# Altium schematic sheet 11_BREAK_OFF.SchDoc: SENSEI Base Board - Breakoff
size A3; DrawnBy: Sebastian Frey; Organization: Integrated Systems Laboratory; DocumentNumber: 12; Revision: v1.1; SheetNumber: 12; SheetTotal: 12
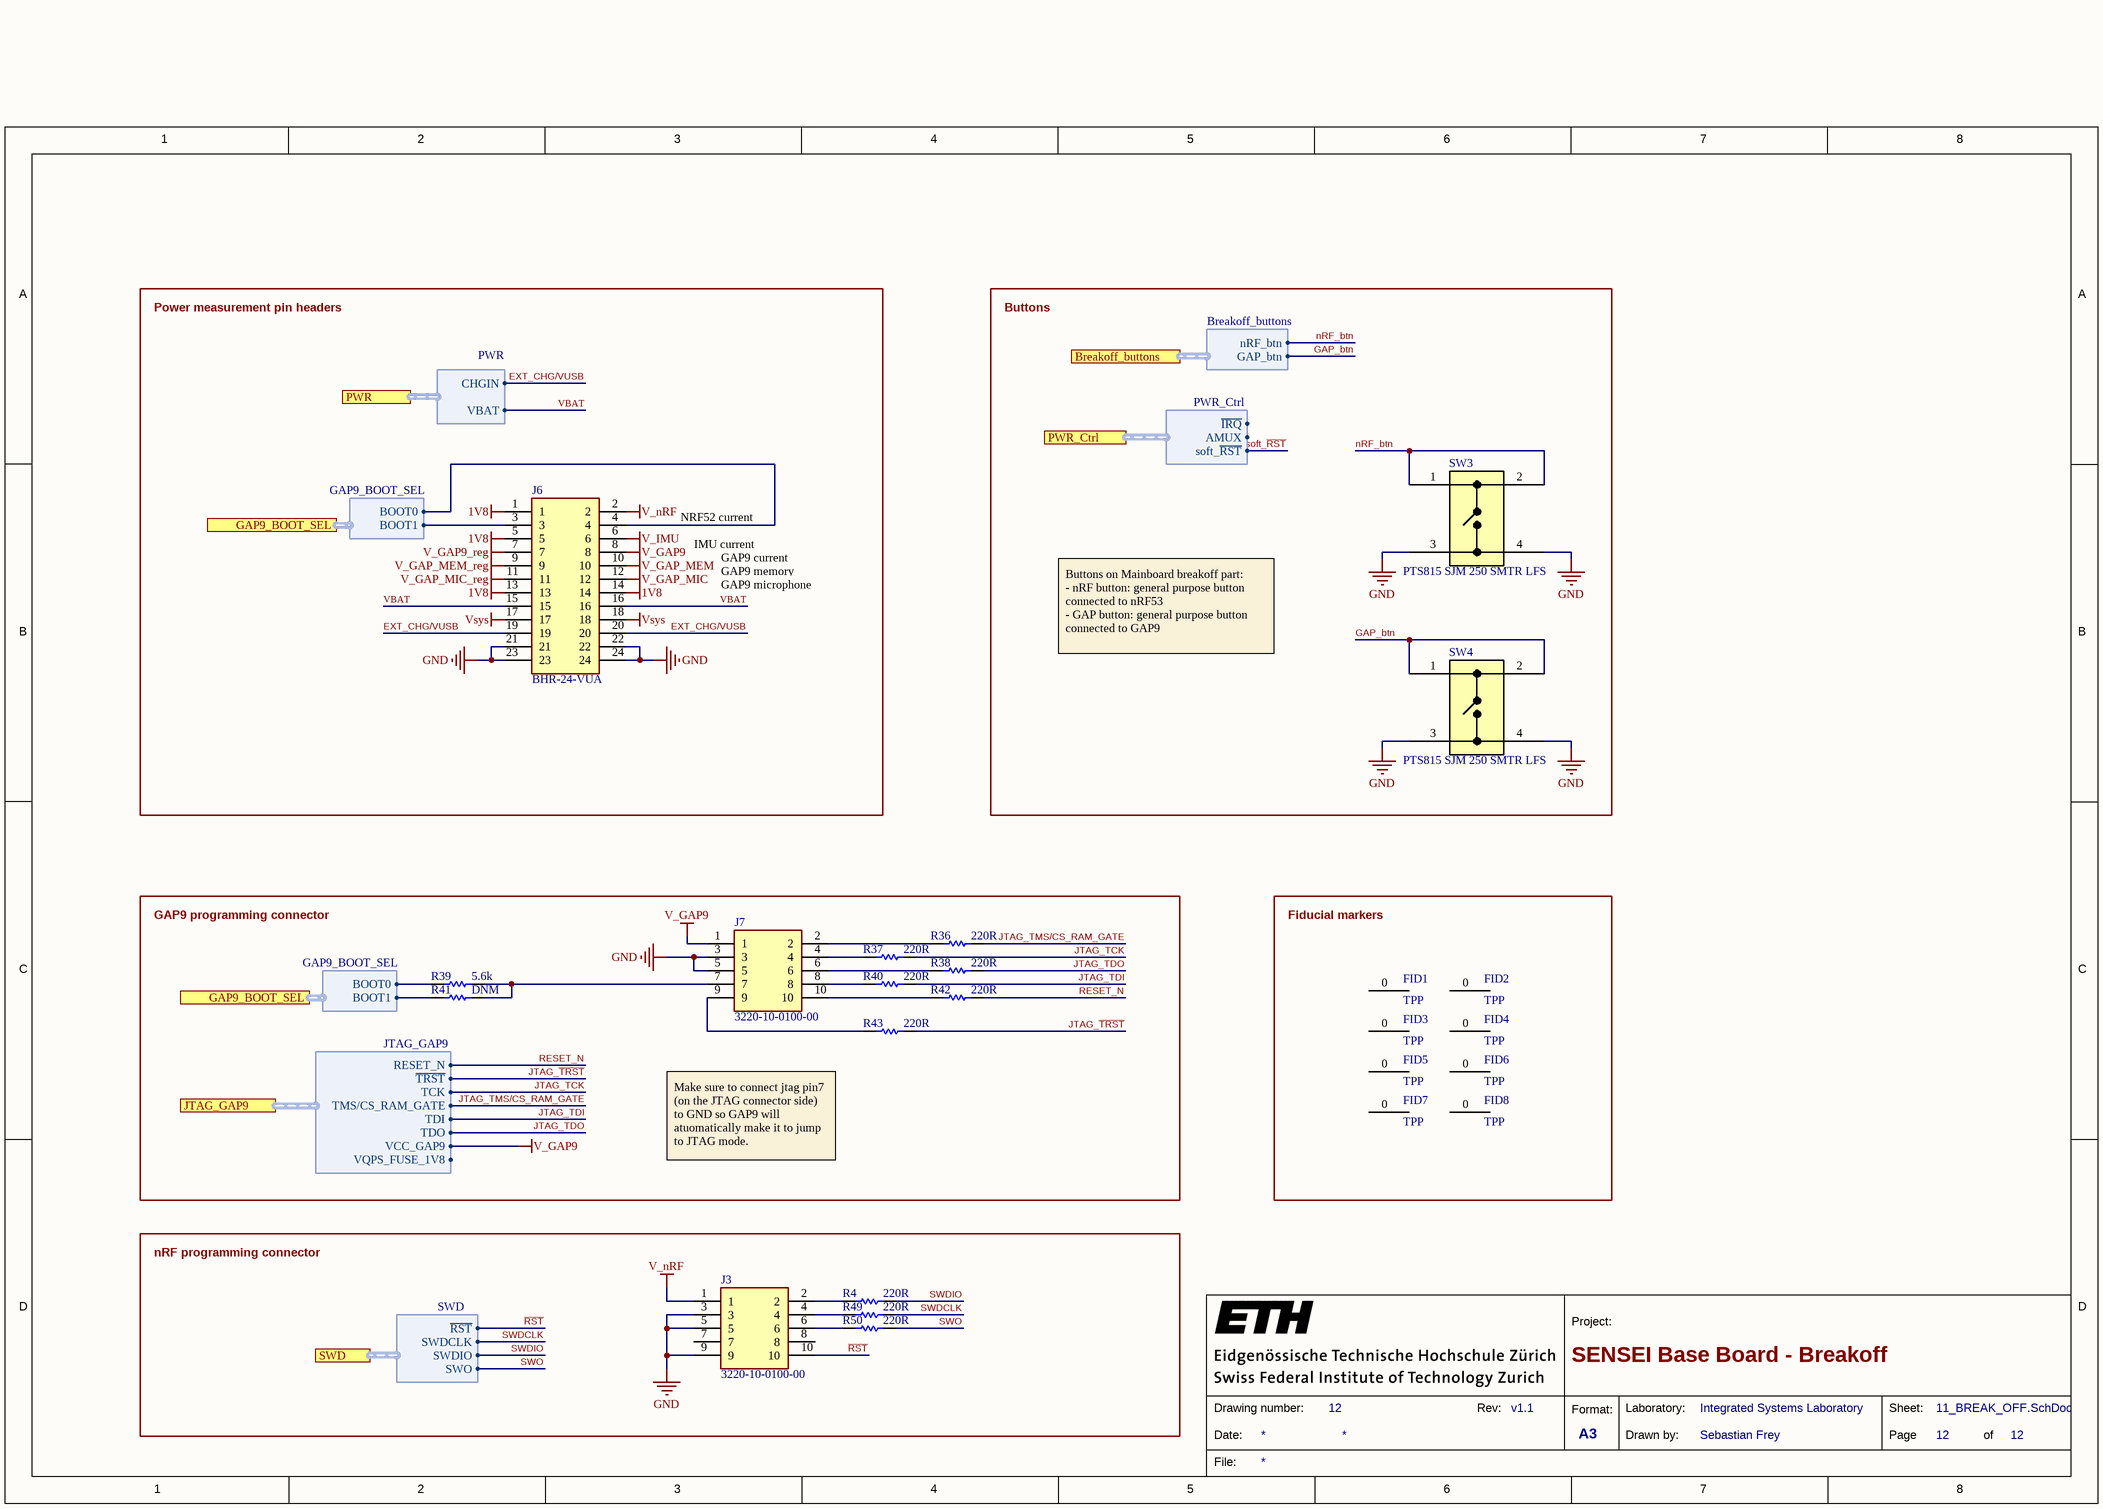
[diagram p0: 11_BREAK_OFF.SchDoc]

## Parts
FID1  TPP  [TPP]
FID2  TPP  [TPP]
FID3  TPP  [TPP]
FID4  TPP  [TPP]
FID5  TPP  [TPP]
FID6  TPP  [TPP]
FID7  TPP  [TPP]
FID8  TPP  [TPP]
J3  3220-10-0100-00  [322010010000]
J6  BHR-24-VUA  [SHDR24W64P254_2X12_3808X880X910P]
J7  3220-10-0100-00  [322010010000]
R4  value 220R  [RESC0603X28X15NL05T05]  (hidden comment: CRCW0201220RFKED)
R36  value 220R  [RESC0603X28X15NL05T05]  (hidden comment: CRCW0201220RFKED)
R37  value 220R  [RESC0603X28X15NL05T05]  (hidden comment: CRCW0201220RFKED)
R38  value 220R  [RESC0603X28X15NL05T05]  (hidden comment: CRCW0201220RFKED)
R39  Resistance: 5.6k  [RESC1608X55X30ML20T10]  (hidden comment: RK73B1JTTD562J)
R40  value 220R  [RESC0603X28X15NL05T05]  (hidden comment: CRCW0201220RFKED)
R41  DNM  [RESC1608X55X30ML20T10]
R42  value 220R  [RESC0603X28X15NL05T05]  (hidden comment: CRCW0201220RFKED)
R43  value 220R  [RESC0603X28X15NL05T05]  (hidden comment: CRCW0201220RFKED)
R49  value 220R  [RESC0603X28X15NL05T05]  (hidden comment: CRCW0201220RFKED)
R50  value 220R  [RESC0603X28X15NL05T05]  (hidden comment: CRCW0201220RFKED)
SW3  PTS815 SJM 250 SMTR LFS  [SW4_PTS815 SJM 250 SMTR LFS_CNK]
SW4  PTS815 SJM 250 SMTR LFS  [SW4_PTS815 SJM 250 SMTR LFS_CNK]

## Blocks framed on the sheet
Power measurement pin headers: J6
Buttons: SW3 SW4
GAP9 programming connector: J7 R36-R43
Fiducial markers: FID1-FID8
nRF programming connector: J3 R4 R49 R50

## Ports
Breakoff_buttons (harness Breakoff_buttons), GAP9_BOOT_SEL (harness GAP9_BOOT_SEL), JTAG_GAP9 (harness JTAG_GAP9), PWR (harness PWR), PWR_Ctrl (harness PWR_Ctrl), SWD (harness SWD)

## Harnesses
PWR: CHGIN, VBAT
GAP9_BOOT_SEL: BOOT0, BOOT1
Breakoff_buttons: nRF_btn, GAP_btn
JTAG_GAP9: ~{TRST}, TCK, TMS/CS_RAM_GATE, TDI, TDO, VCC_GAP9, RESET_N, VQPS_FUSE_1V8
SWD: ~{RST}, SWDIO, SWDCLK, SWO
PWR_Ctrl: ~{IRQ}, AMUX, soft_~{RST}

## Nets
1V8: J6.1 J6.5 J6.13 J6.14
GND: J3.3 J3.5 J3.9 J6.21 J6.22 J6.23 J6.24 J7.3 J7.5 SW3.3 SW3.4 SW4.3 SW4.4
V_GAP9: J6.8 J7.1 ; port JTAG_GAP9.VCC_GAP9
V_GAP9_reg: J6.7
V_GAP_MEM: J6.10
V_GAP_MEM_reg: J6.9
V_GAP_MIC: J6.12
V_GAP_MIC_reg: J6.11
V_IMU: J6.6
V_nRF: J3.1 J6.2
Vsys: J6.17 J6.18
EXT_CHG/VUSB: J6.19 J6.20 ; port PWR.CHGIN
GAP_btn: SW4.1 SW4.2 ; port Breakoff_buttons.GAP_btn
JTAG_~{TRST}: R43.2 ; port JTAG_GAP9.~{TRST}
JTAG_TCK: R37.2 ; port JTAG_GAP9.TCK
JTAG_TDI: R40.2 ; port JTAG_GAP9.TDI
JTAG_TDO: R38.2 ; port JTAG_GAP9.TDO
JTAG_TMS/CS_RAM_GATE: R36.2 ; port JTAG_GAP9.TMS/CS_RAM_GATE
nRF_btn: SW3.1 SW3.2 ; port Breakoff_buttons.nRF_btn
~{RST}: J3.10 ; port SWD.~{RST}
RESET_N: R42.2 ; port JTAG_GAP9.RESET_N
soft_~{RST}: port PWR_Ctrl.soft_~{RST}
SWDCLK: R49.2 ; port SWD.SWDCLK
SWDIO: R4.2 ; port SWD.SWDIO
SWO: R50.2 ; port SWD.SWO
VBAT: J6.15 J6.16 ; port PWR.VBAT
NetJ3_2: J3.2 R4.1
NetJ3_4: J3.4 R49.1
NetJ3_6: J3.6 R50.1
NetJ6_3: J6.3 R41.1 ; port GAP9_BOOT_SEL.BOOT1
NetJ6_4: J6.4 R39.1 ; port GAP9_BOOT_SEL.BOOT0
NetJ7_2: J7.2 R36.1
NetJ7_4: J7.4 R37.1
NetJ7_6: J7.6 R38.1
NetJ7_7: J7.7 R39.2 R41.2
NetJ7_8: J7.8 R40.1
NetJ7_9: J7.9 R43.1
NetJ7_10: J7.10 R42.1

Not connected (* = marked no-connect by the designer): FID1 0(2); FID2 0(2); FID3 0(2); FID4 0(2); FID5 0(2); FID6 0(2); FID7 0(2); FID8 0(2); J3 7 8

## Notes on the sheet
- NRF52 current
- IMU current
- GAP9 current
- GAP9 memory current
- GAP9 microphone current
- Buttons on Mainboard breakoff part:
  - nRF button: general purpose button connected to nRF53
  - GAP button: general purpose button connected to GAP9
- Make sure to connect jtag pin7  (on the JTAG connector side) to GND so GAP9 will atuomatically make it to jump to JTAG mode.
- 1
- 2
- 3
- 4
- 5
- 6
- 7
- 8
- A
- B
- C
- D
- Project:
- Date:
- Drawing number:
- Rev:
- Format:
- A3
- Drawn by:
- Laboratory:
- Page
- Sheet:
- of
- File:

## Library data of the parts
J3 J7 = 3220-10-0100-00: Connector; Manufacturer_Name: CNC Tech; Datasheet Link: https://datasheet.datasheetarchive.com/originals/dk/DKDS-7/133059.pdf; Height: 5.6mm; Manufacturer_Part_Number: 3220-10-0100-00; Arrow Part Number: 3220-10-0100-00; Arrow Price/Stock: https://www.arrow.com/en/products/3220-10-0100-00/cnc-tech-llc?region=nac
J6 = BHR-24-VUA: Connector; Manufacturer_Name: Adam Tech; Datasheet Link: https://datasheet.datasheetarchive.com/originals/distributors/Datasheets_SAMA/695a8166aa40898d0a6b5857fa89f6fe.pdf; Height: 9.1mm; Manufacturer_Part_Number: BHR-24-VUA; Arrow Part Number: BHR-24-VUA; Arrow Price/Stock: https://www.arrow.com/en/products/bhr-24-vua/adam-tech
R4 R36-R38 R40 R42 R43 R49 R50 = CMP-2004-00982-1: Manufacturer: Vishay Dale; Part Number: CRCW0201220RFKED
R39 = CMP-2000-01007-1: Manufacturer: KOA Speer; Part Number: RK73B1JTTD562J
R41 = CMP-2000-01007-1: Part Number: RK73B1JTTD562J; Manufacturer: KOA Speer; Resistance: DNM
SW3 SW4 = PTS815 SJM 250 SMTR LFS: No Description Available; Mfr_Name: C&K Components; Copyright: Copyright (C) 2023 Ultra Librarian. All rights reserved.; Manufacturer_Part_Number: PTS815 SJM 250 SMTR LFS; RefDes: RefDes; Type: DEV